# EAGLE design Metaldetector2. (EAGLE 7.1.0)
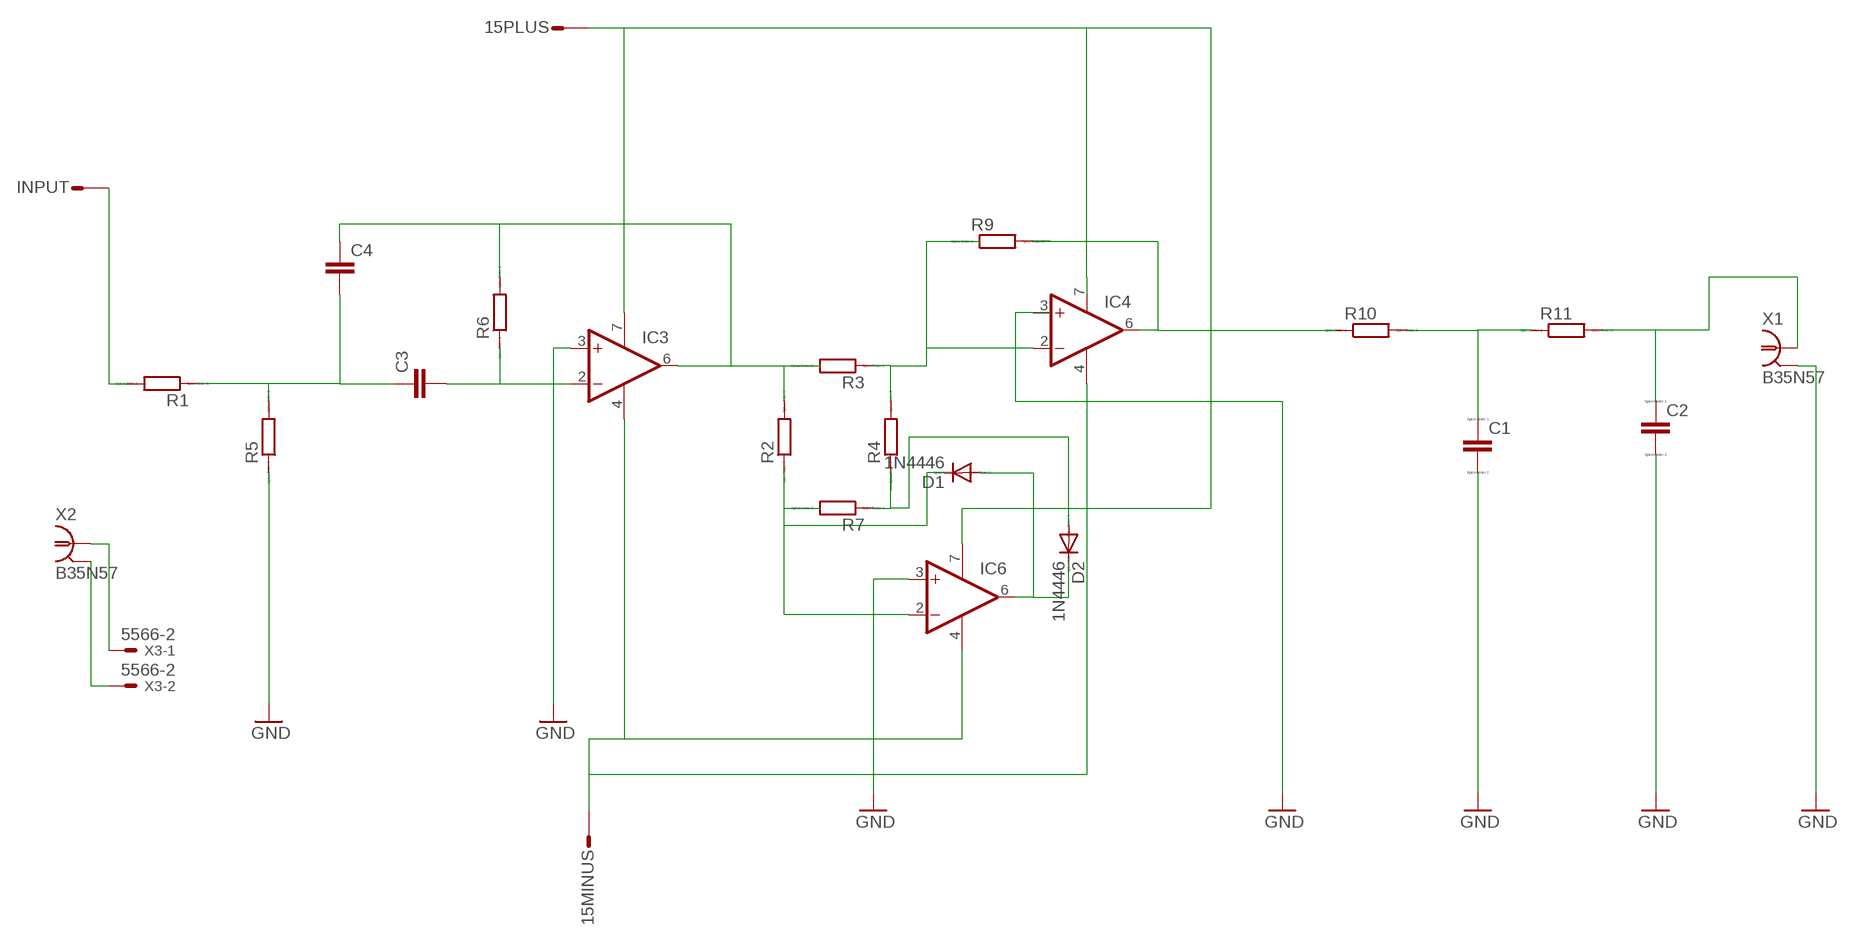
[diagram p0: schematic, sheet 1]

## Parts
15MINUS  ST2,8  [ST2,8]
15PLUS  ST2,8  [ST2,8]
C1  C-EU025-040X050  [C025-040X050]
C2  C-EU025-040X050  [C025-040X050]
C3  C2.5/5  [C2.5-5]
C4  C2.5/5  [C2.5-5]
D1  1N4446  [DO35-10]
D2  1N4446  [DO35-10]
IC3  1AMP_P7+4N  [DIL08]
IC4  1AMP_P7+4N  [DIL08]
IC6  1AMP_P7+4N  [DIL08]
INPUT  ST2,8  [ST2,8]
R1  R0207/10  [0207/10]
R2  R0207/10  [0207/10]
R3  R0207/10  [0207/10]
R4  R0207/10  [0207/10]
R5  R0207/10  [0207/10]
R6  R0207/10  [0207/10]
R7  R0207/10  [0207/10]
R9  R0207/10  [0207/10]
R10  R0204/7  [0204/7]
R11  R0204/7  [0204/7]
X1  B35N57  [B35N57]
X2  B35N57  [B35N57]
X3  5566-2  [5566-2]

## Nets
GND: C1.2 C2.2 IC3.3(+IN) IC4.3(+IN) IC6.3(+IN) R5.1 X1.2 X1.3 X1.4 X1.5
N$1: C1.1 R10.2 R11.1
N$2: C3.1 C4.2 R1.1 R5.2
N$3: C3.2 IC3.2(-IN) R6.1
N$4: C4.1 IC3.6(OUT) R2.2 R3.2 R6.2
N$5: D1.C IC6.2(-IN) R2.1 R7.2
N$6: C2.1 R11.2 X1.1
N$7: D2.A R4.1 R7.1
N$8: IC4.2(-IN) R3.1 R4.2 R9.1
N$9: IC4.6(OUT) R9.2 R10.1
N$10: 15MINUS.1(ST) IC3.4(V-) IC4.4(V-) IC6.4(V-)
N$11: D1.A D2.C IC6.6(OUT)
N$13: INPUT.1(ST) R1.2
N$15: 15PLUS.1(ST) IC3.7(V+) IC4.7(V+) IC6.7(V+)
N$16: X2.1 X3.1
N$17: X2.2 X2.3 X2.4 X2.5 X3.2

## Library data of the parts
15MINUS 15PLUS INPUT = con-rib:ST2,8: RIBBON CABLE CONNECTOR Flachstecker / Faston; OC_FARNELL: unknown; OC_NEWARK: unknown
C1 C2 = resistor:C-EU: CAPACITOR, European symbol; SPICEPREFIX: C
C3 C4 = capacitor-wima:C: CAPACITOR naming: grid - package width
D1 D2 = diode:1N4446: DIODE high speed (Philips)
IC3 IC4 IC6 = linear:1AMP_P7+4: OP AMP
R1-R7 R9-R11 = eagle-ltspice:R: RESISTOR, European symbol; SPICEMODEL: NONE; SPICEPREFIX: R
X1 X2 = con-coax:B35N57: BNC CONNECTOR M/A COM www.macom.com; OC_FARNELL: unknown; OC_NEWARK: unknown
X3 = con-molex:5566-2: Mini FIT connector 2 pol Source: http://www.molex.com; OC_FARNELL: 1822072; OC_NEWARK: unknown

## Net classes
0 default: width 0.305 mm, drill 0.508 mm, clearance 0.254 mm

## Board
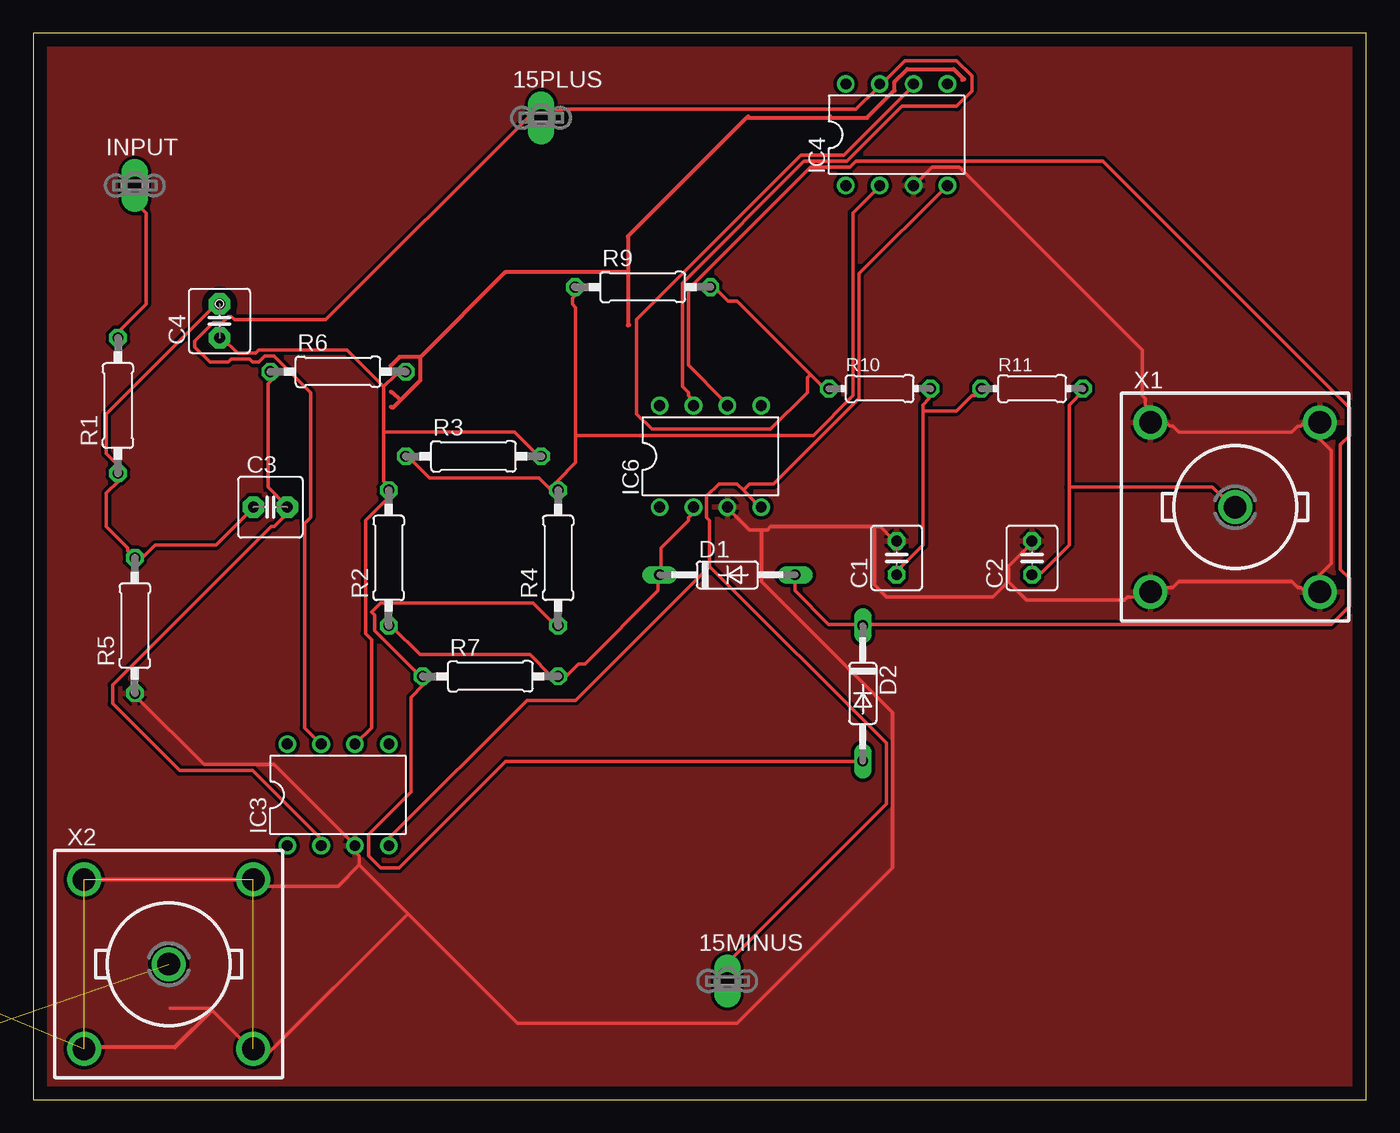
[diagram p1: board, top side]
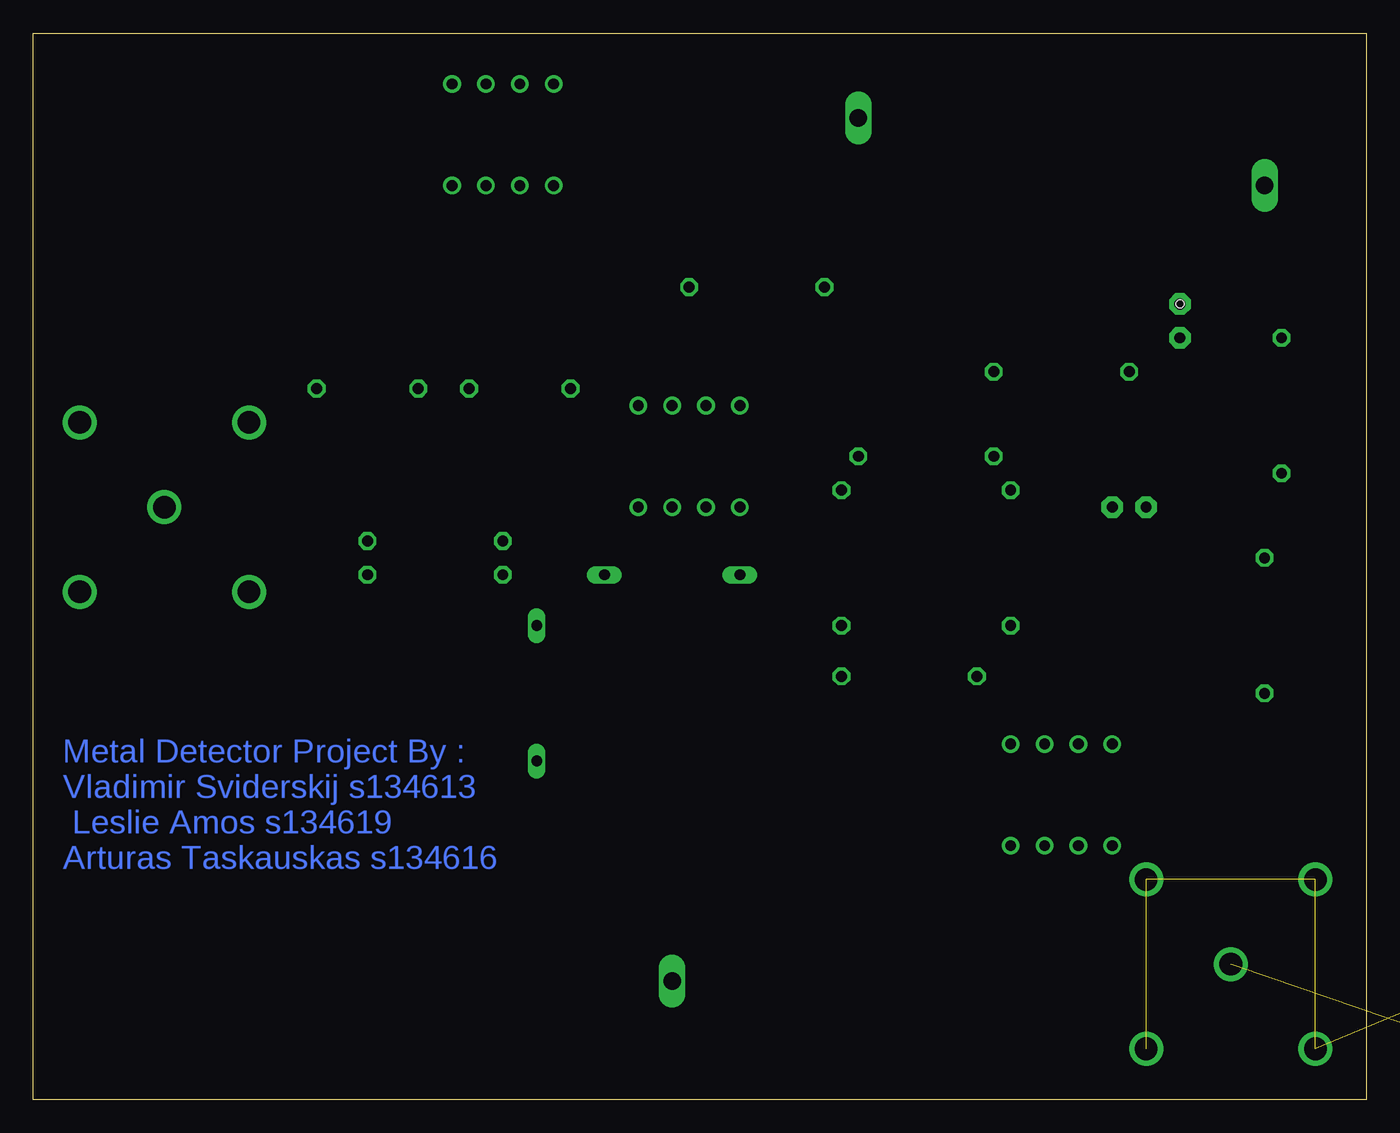
[diagram p2: board, bottom side, seen from below]

Size 100 x 80 mm. Coordinates in mm from the lower left corner, seen from the top.
Outline: 0,0 100,0 100,80 0,80 0,0
Copper layers (1*16): Top 0.035mm / dielectric 1.5mm / Bottom 0.035mm
Design rules "default": minimum track width 10mil, minimum drill 24mil, track to track 8mil, track to pad 8mil, pad to pad 8mil, via to via 8mil, smd to smd 8mil, copper to edge 40mil, drill to drill 8mil, minimum pad ring 10mil, minimum via ring 8mil, stop-mask expansion 4mil, vias tented up to drill 0mil, thermal gap 10mil
Holes 0.6 mm at 13.97,59.69

### Footprints (pad centres in the part's own frame; a part is rotated, then mirrored left to right if it is on the bottom)
ST2,8 = drill 1.321 long: 1 0,0
C025-040X050 = drill 0.813 octagon: 1 -1.27,0; 2 1.27,0
C2.5-5 = drill 0.813 pad 1.6 octagon: 1 -1.27,0; 2 1.27,0
DO35-10 = drill 0.813 long: A 5.08,0; C -5.08,0
DIL08 = drill 0.813 pad 1.27: 1 -3.81,-3.81; 2 -1.27,-3.81; 3 1.27,-3.81; 4 3.81,-3.81; 5 3.81,3.81; 6 1.27,3.81; 7 -1.27,3.81; 8 -3.81,3.81
0207/10 = drill 0.813 octagon: 1 -5.08,0; 2 5.08,0
0204/7 = drill 0.813 octagon: 1 -3.81,0; 2 3.81,0
B35N57 = drill 1.7: 1 0,0; 2 6.35,6.35; 3 -6.35,6.35; 4 -6.35,-6.35; 5 6.35,-6.35
5566-2 = drill 1.4 square: 1 0,-2.75; 2 0,2.75 | hole 3: 4.7,2.29; -4.7,2.29

### Placement (x,y rotation side)
15MINUS  52.07,8.89 0 top
15PLUS  38.1,73.66 0 top
C1  64.77,40.64 90 top
C2  74.93,40.64 90 top
C3  17.78,44.45 0 top
C4  13.97,58.42 90 top
D1  52.07,39.37 0 top
D2  62.23,30.48 270 top
IC3  22.86,22.86 0 top
IC4  64.77,72.39 0 top
IC6  50.8,48.26 0 top
INPUT  7.62,68.58 0 top
R1  6.35,52.07 90 top
R2  26.67,40.64 90 top
R3  33.02,48.26 0 top
R4  39.37,40.64 90 top
R5  7.62,35.56 90 top
R6  22.86,54.61 0 top
R7  34.29,31.75 0 top
R9  45.72,60.96 0 top
R10  63.5,53.34 0 top
R11  74.93,53.34 0 top
X1  90.17,44.45 0 top
X2  10.16,10.16 0 top
X3  -8.89,6.35 0 top  (outside the outline)

### Tracks (layer width: path | path; a pad name or v marks a point on that pad's centre or on a via)
GND
  Top 0.254: 96.47,38.18 96.47,39.32 97.38,40.23 97.38,48.69 96.47,49.61 96.47,50.75 | IC4.3 66.06,68.58 67.44,69.95 69.49,69.95 83.21,56.24 83.21,52.81 83.44,52.58 83.44,52.12 83.67,51.89 83.67,50.98 X1.3 83.9,50.75 85.04,50.75 85.27,50.52 85.5,50.52 85.95,50.06 94.41,50.06 94.87,50.52 95.1,50.52 95.33,50.75 96.47,50.75 | 96.47,50.75 X1.2 | R5.1 7.77,30.4 7.77,30.18 12.8,25.15 18.06,25.15 24,19.2 IC3.3 24.23,18.97 24.23,18.52 24.46,18.29 24.46,17.6 | 63.09,42.98 55.32,42.98 55.09,42.75 54.63,42.75 | 63.09,42.98 63.55,42.98 64.47,42.06 64.69,42.06 C1.2 | 54.63,42.75 53.72,42.75 52.12,44.35 IC6.3 | 73.15,38.86 73.15,40.01 74.75,41.6 74.75,41.83 C2.2 | 73.15,38.86 74.52,37.49 81.84,37.49 82.07,37.72 83.44,37.72 X1.4 84.12,38.41 85.5,38.41 85.95,38.86 94.41,38.86 94.87,38.41 95.1,38.41 95.33,38.18 96.47,38.18 | 63.09,42.98 63.09,38.63 64.01,37.72 72.01,37.72 73.15,38.86 | 28.12,13.95 36.35,5.71 52.81,5.71 64.47,17.37 64.47,29.03 54.63,38.86 54.63,42.75 | 28.12,13.95 24.46,17.6 | 96.47,38.18 X1.5 | 17.14,16 22.86,16 24.46,17.6 | 28.12,13.95 17.14,2.97 16.48,3.63 13.41,6.71 13.26,6.86 10.29,6.86
  Top 0.305: 3.91,3.91 10.62,3.91 13.41,6.71 | 3.91,16.48 16.48,16.48 17.04,15.93 17.14,16
  pour Top: -1.27,-1.27 -1.27,81.28 101.6,81.28 101.6,80.01 101.6,-1.27
N$1
  Top 0.254: 66.75,51.66 66.75,52.12 67.21,52.58 67.21,53.26 R10.2 | 66.75,51.66 66.75,41.6 64.92,39.78 64.92,39.55 C1.1 | 66.75,51.66 69.27,51.66 70.41,52.81 70.64,52.81 71.09,53.26 R11.1
N$2
  Top 0.254: C3.1 16.46,44.35 13.72,41.6 9.14,41.6 8.23,40.69 7.77,40.69 R5.2 7.54,40.69 7.09,41.15 7.09,41.38 5.49,42.98 5.49,45.49 6.4,46.41 6.4,46.86 R1.1 6.4,47.09 6.4,47.55 5.49,48.46 5.49,51.44 13.72,59.66 13.95,59.66 C4.2
N$3
  Top 0.254: IC3.2 21.49,19.2 21.49,19.66 16.46,24.69 10.97,24.69 5.94,29.72 5.94,31.09 17.83,42.98 18.06,42.98 18.97,43.89 18.97,44.35 C3.2 18.97,44.58 17.6,45.95 17.6,53.72 17.83,53.95 17.83,54.41 R6.1
N$4
  Top 0.254: 26.52,45.72 26.52,45.03 24.92,43.43 24.92,34.98 25.38,34.52 25.38,27.89 24.23,26.75 IC3.6 | 26.29,53.49 27.2,54.41 27.89,54.41 R6.2 | 26.29,50.06 26.29,46.41 26.52,46.18 26.52,45.72 | 26.29,50.06 26.29,53.49 | 26.52,45.72 R2.2 | 26.29,50.06 36.12,50.06 37.72,48.46 37.95,48.46 R3.2 | 26.29,53.49 23.55,56.24 16.92,56.24 16.69,56.01 15.32,56.01 14.17,57.15 C4.1
N$5
  Top 0.254: IC6.2 49.38,44.35 49.38,43.89 49.15,43.66 49.15,43.43 47.09,41.38 47.09,39.55 D1.C 46.86,39.32 46.86,38.18 41.38,32.69 40.92,32.69 40.01,31.77 39.55,31.77 R7.2 39.32,31.77 38.86,31.77 37.26,33.38 29.03,33.38 26.98,35.43 26.75,35.43 R2.1
N$6
  Top 0.254: 77.72,45.95 77.72,52.12 78.87,53.26 R11.2 | 77.72,45.95 77.72,41.6 75.67,39.55 74.98,39.55 C2.1 | 77.72,45.95 88.47,45.95 89.15,45.26 89.38,45.26 90.07,44.58 X1.1
N$7
  Top 0.254: R4.1 39.32,35.43 37.49,37.26 26.06,37.26 25.38,36.58 25.6,36.35 25.6,35.2 29.03,31.77 R7.1 29.26,31.55 29.26,31.09 28.35,30.18 28.35,23.09 25.15,19.89 25.15,18.29 26.06,17.37 27.43,17.37 35.43,25.38 62.18,25.38 D2.A
N$8
  Top 0.254: 39.32,45.72 38.86,45.72 37.95,46.63 29.72,46.63 28.12,48.23 R3.1 | 40.69,49.84 40.69,47.78 39.32,46.41 39.32,45.72 | 40.69,49.84 40.69,59.44 40.46,59.66 40.46,60.12 40.69,60.35 40.69,60.81 R9.1 | 39.32,45.72 R4.2 | 40.69,49.84 58.52,49.84 61.49,52.81 61.49,66.52 63.32,68.35 63.32,68.58 IC4.2
N$9
  Top 0.254: 58.29,54.41 52.81,59.89 52.12,59.89 50.98,61.04 R9.2 | 58.29,54.41 59.21,53.49 59.66,53.49 R10.1 | 58.29,54.41 58.06,54.18 58.06,53.03 55.32,50.29 46.41,50.29 45.26,51.44 45.26,58.52 57.61,70.87 60.81,70.87 65.84,75.89 65.84,76.12 IC4.6
N$10
  Top 0.254: 50.75,40.01 40.69,29.95 37.03,29.95 26.75,19.66 26.75,19.2 IC3.4 | 50.75,40.01 50.75,43.43 50.52,43.66 50.52,45.26 51.44,46.18 52.81,46.18 53.26,45.72 | 53.26,45.72 54.18,44.81 54.41,44.81 54.63,44.58 IC6.4 | IC4.4 61.95,61.95 61.95,52.58 55.55,46.18 53.72,46.18 53.26,45.72 | 50.75,40.01 64.01,26.75 64.01,22.17 52.12,10.29 52.12,8.91 15MINUS.1
N$11
  Top 0.254: D1.A 57.15,38.18 59.66,35.66 62.18,35.66 D2.C 62.41,35.66 97.38,35.66 98.75,37.03 98.75,39.09 98.07,39.78 98.07,49.15 98.75,49.84 98.75,51.89 80.24,70.41 61.72,70.41 61.27,69.95 58.29,69.95 49.15,60.81 49.15,55.09 51.89,52.35 51.89,52.12 IC6.6
N$12
  Top 0.305: 69.85,76.56 69.83,76.57 69.69,76.52 69.69,76.68 69.06,77.31 65.56,77.31 64.61,76.36 64.61,75.72 62.55,73.66 59.85,73.66 59.79,73.71 | 26.82,55.04 26.82,55.07 26.83,55.09 27.46,55.72 29.05,55.72 | 59.79,73.76 59.79,73.71 | 44.7,58.12 44.68,58.12 44.61,58.1 44.61,62.07 | 26.82,53.09 26.87,53.09 26.99,53.02 27.54,52.47 | 53.65,73.76 53.65,73.71 | 26.82,51.97 26.87,51.97 26.99,51.91 27.54,52.47 | 29.05,55.72 29.05,53.98 27.54,52.47 | 44.61,62.07 44.61,64.77 53.5,73.66 53.65,73.71 | 29.05,55.72 35.4,62.07 44.61,62.07 | 59.79,73.71 59.69,73.66 53.66,73.66 53.65,73.71
N$13
  Top 0.254: R1.2 6.4,57.15 6.4,57.61 8.46,59.66 8.46,66.52 7.77,67.21 7.77,68.58 INPUT.1
N$15
  Top 0.254: IC6.7 49.38,52.12 49.38,52.58 49.15,52.81 49.15,53.03 48.69,53.49 48.69,61.27 57.84,70.41 61.04,70.41 65.15,74.52 69.27,74.52 70.41,75.67 70.41,76.81 69.27,77.95 65.38,77.95 63.55,76.12 IC4.7 63.32,76.12 63.32,75.89 61.72,74.3 38.63,74.3 38.18,73.84 15PLUS.1 37.95,73.61 37.03,73.61 21.95,58.52 15.09,58.52 14.86,58.75 14.63,58.75 14.17,58.29 13.49,58.29 12.12,56.92 12.12,56.46 13.26,55.32 14.63,55.32 14.86,55.55 16.23,55.55 16.46,55.32 16.92,55.32 17.37,55.78 18.06,55.78 20.8,53.03 20.8,43.66 20.34,43.2 20.34,27.89 21.49,26.75 IC3.7
N$16  (1 unrouted)
N$17  (4 unrouted)

### Text on the board
Bottom: Metal Detector Project By : / Vladimir Sviderskij s134613 / Leslie Amos s134619 / Arturas Taskauskas s134616